# Altium schematic sheet AdapterBoard.SchDoc
size C
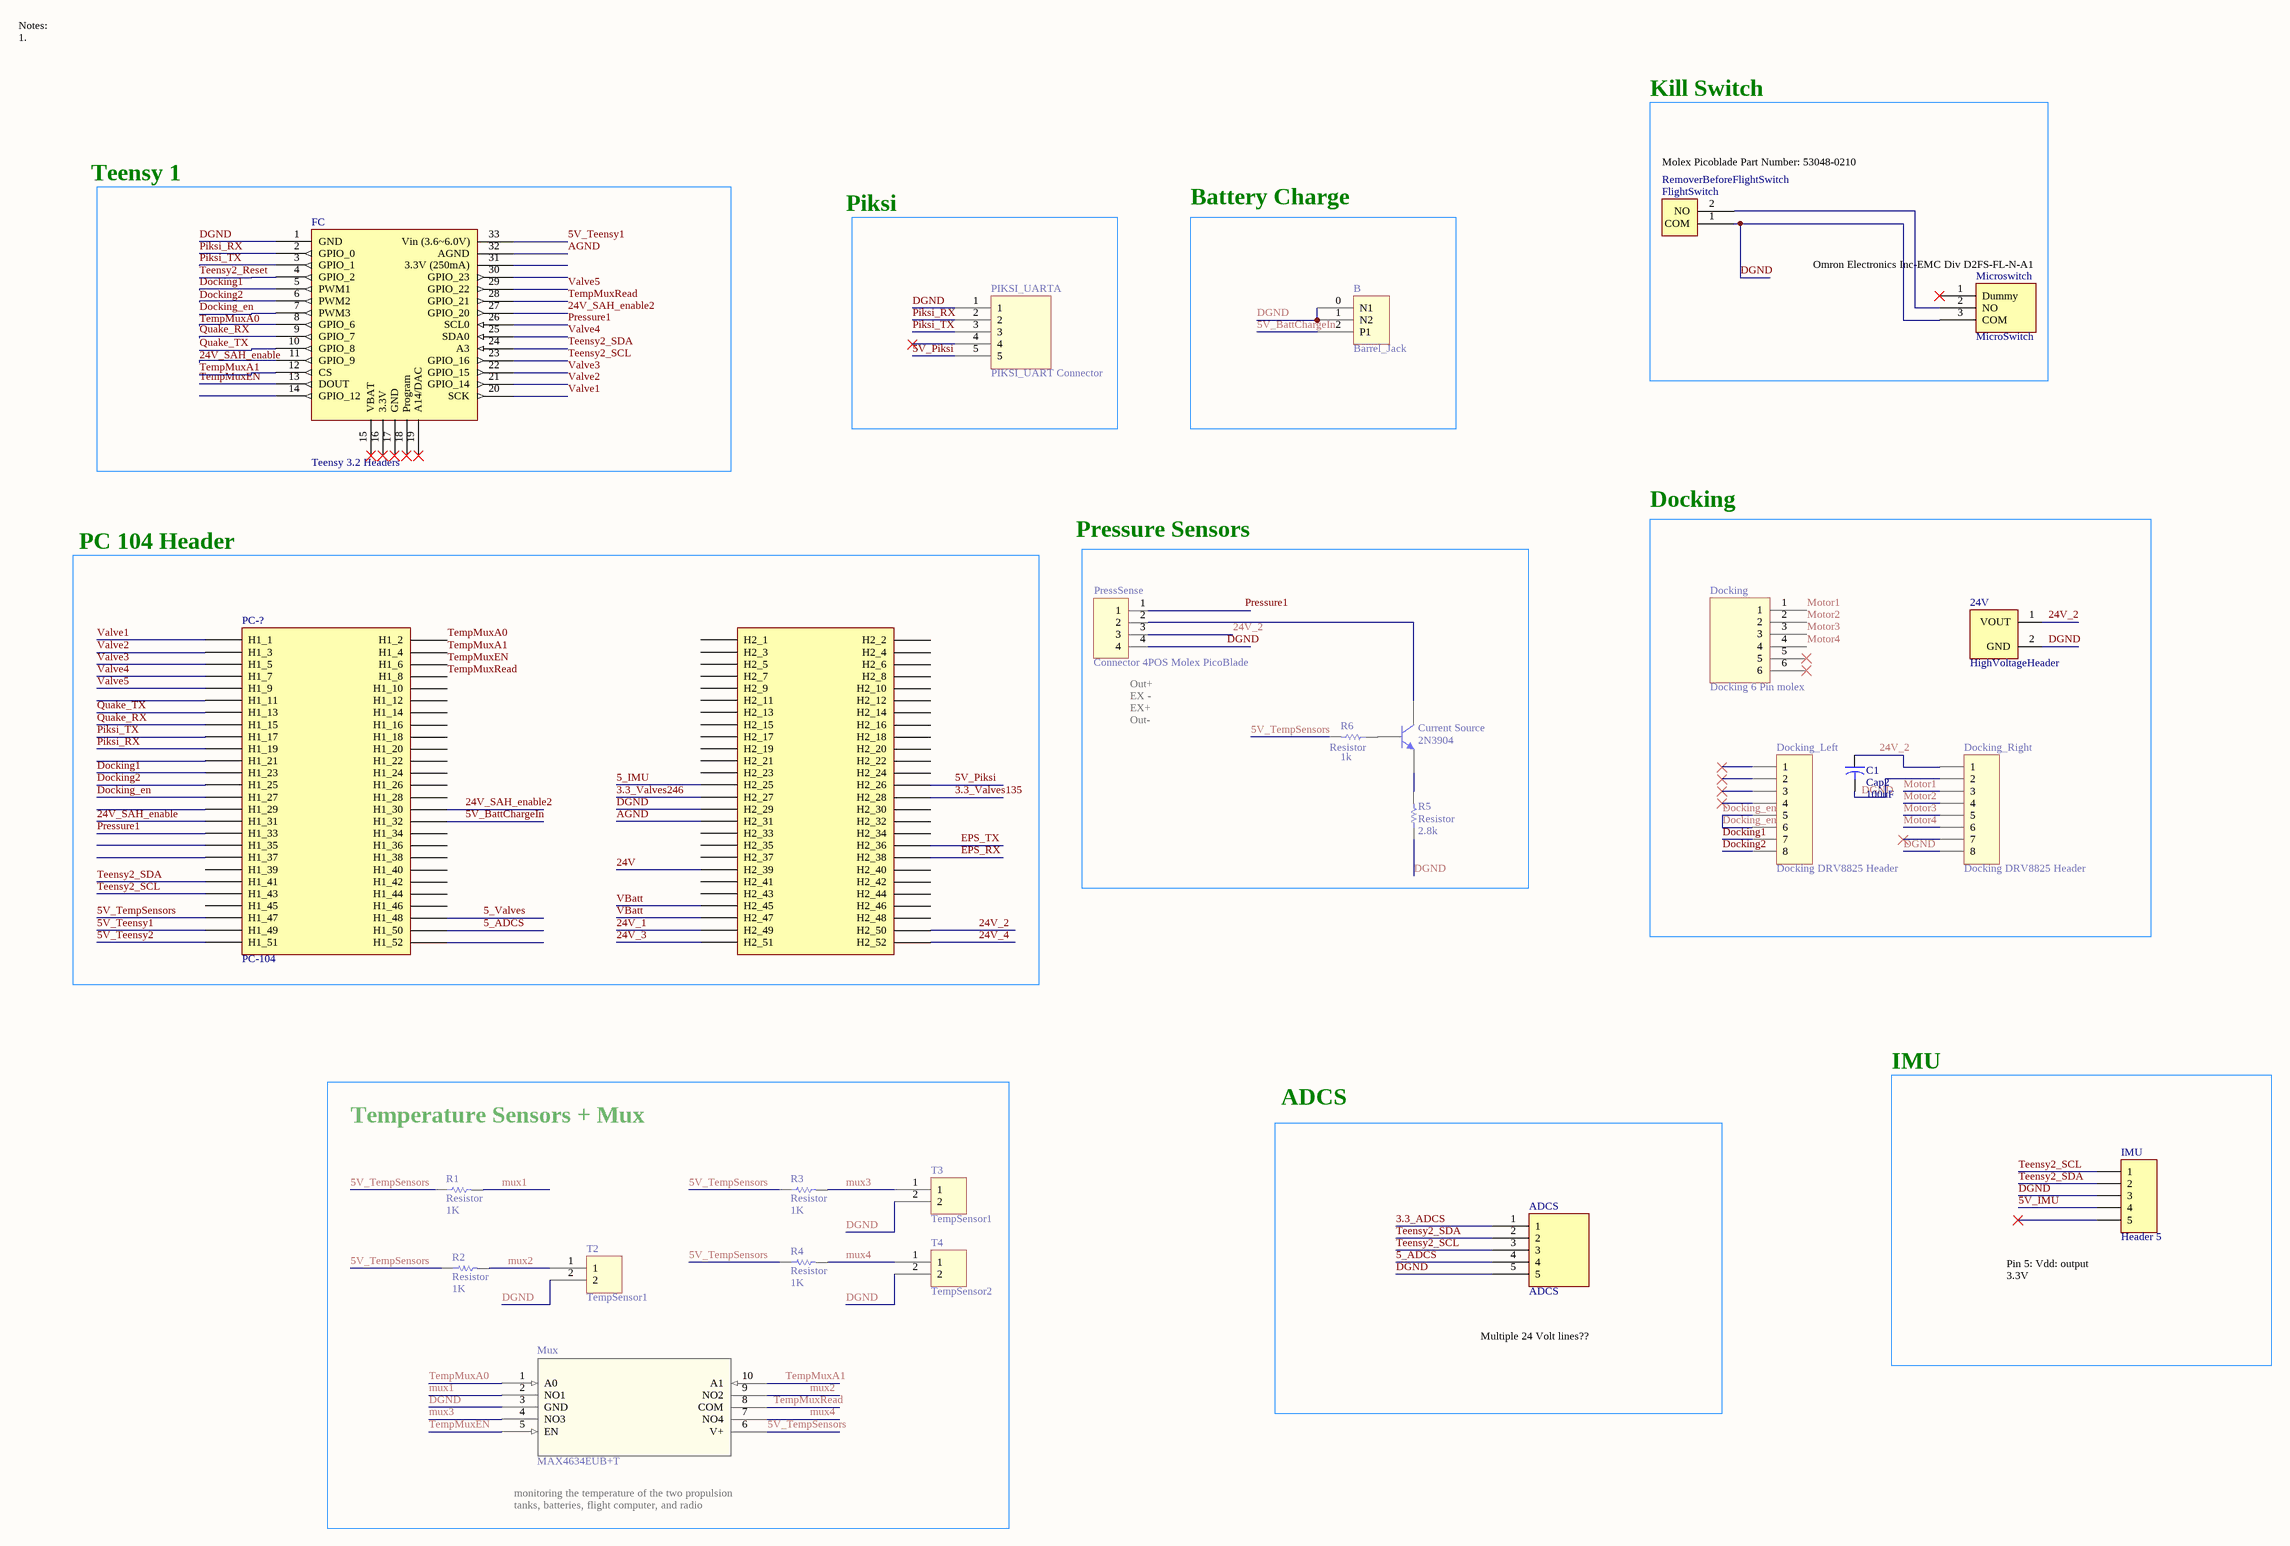
[diagram p0: AdapterBoard.SchDoc]

## Parts
24V  HighVoltageHeader  [Header]
ADCS  ADCS  [Molex Picoblade 5 Pin]
B  Barrel_Jack  [Barrel_Jack]
C1  Cap2  value 100uF  [CAPR5-4X5]
Current_Source  2N3904  [TO-92A]
Docking  Docking 6 Pin molex  [Pressure Connector]
Docking_Left  Docking DRV8825 Header  [HDR1X8]
Docking_Right  Docking DRV8825 Header  [HDR1X8]
FC  Teensy 3.2 Headers  [Teensy 3.2 SMD Headers]
FlightSwitch  RemoverBeforeFlightSwitch  [RemoverBeforeFlight Switch]
IMU  Header 5  [HDR1X5]
Microswitch  MicroSwitch  [MicroSwitch_3pin]
Mux  MAX4634EUB+T  [21-0061L]
PC-?  PC-104  [PC-104FOOTPRINT]
PIKSI_UARTA  PIKSI_UART Connector  [Molex Picoblade 5 Pin]
PressSense  Connector 4POS Molex PicoBlade  [532610471]
R1  Resistor  value 1K  [AXIAL-0.3]
R2  Resistor  value 1K  [AXIAL-0.3]
R3  Resistor  value 1K  [AXIAL-0.3]
R4  Resistor  value 1K  [AXIAL-0.3]
R5  Resistor  value 2.8k  [AXIAL-0.3]
R6  Resistor  value 1k  [AXIAL-0.3]
T2  TempSensor1  [RemoverBeforeFlight Switch]
T3  TempSensor1  [RemoverBeforeFlight Switch]
T4  TempSensor2  [RemoverBeforeFlight Switch]

## Blocks framed on the sheet
Kill Switch: FlightSwitch Microswitch
Battery Charge: B
Docking: 24V C1 Docking Docking_Left Docking_Right
PC 104 Header: PC-?
Temperature Sensors + Mux: Mux R1-R4 T2-T4
IMU: IMU
ADCS: ADCS

## Nets
3.3_ADCS: ADCS.1
3.3_Valves135: PC-?.H2_28
3.3_Valves246: PC-?.H2_27
5_ADCS: ADCS.4 PC-?.H1_50
5_IMU: PC-?.H2_25
5_Valves: PC-?.H1_48
5V_BattChargeIn: B.2(P1) PC-?.H1_32
5V_IMU: IMU.4
5V_Piksi: PC-?.H2_26 PIKSI_UARTA.5
5V_Teensy1: FC.33(Vin_(3.6~6.0V)) PC-?.H1_49
5V_Teensy2: PC-?.H1_51
5V_TempSensors: Mux.6(V+) PC-?.H1_47 R1.1 R2.1 R3.1 R4.1 R6.2
24V: PC-?.H2_39
24V_1: PC-?.H2_49
24V_2: 24V.1(VOUT) C1.1 Docking_Right.1 PC-?.H2_50 PressSense.3
24V_3: PC-?.H2_51
24V_4: PC-?.H2_52
24V_SAH_enable: FC.11(GPIO_9) PC-?.H1_31
24V_SAH_enable2: FC.27(GPIO_20) PC-?.H1_30
AGND: FC.32(AGND) PC-?.H2_31
DGND: 24V.2(GND) ADCS.5 B.0(N1) B.1(N2) C1.2 Docking_Right.2 Docking_Right.8 FC.1(GND) FlightSwitch.1(COM) IMU.3 Microswitch.3(COM) Mux.3(GND) PC-?.H2_29 PIKSI_UARTA.1 PressSense.4 R5.1 T2.2 T3.2 T4.2
Docking1: Docking_Left.7 FC.5(PWM1) PC-?.H1_23
Docking2: Docking_Left.8 FC.6(PWM2) PC-?.H1_25
Docking_en: Docking_Left.5 Docking_Left.6 FC.7(PWM3) PC-?.H1_27
EPS_RX: PC-?.H2_38
EPS_TX: PC-?.H2_36
Motor1: Docking.1 Docking_Right.3
Motor2: Docking.2 Docking_Right.4
Motor3: Docking.3 Docking_Right.5
Motor4: Docking.4 Docking_Right.6
mux1: Mux.2(NO1) R1.2
mux2: Mux.9(NO2) R2.2 T2.1
mux3: Mux.4(NO3) R3.2 T3.1
mux4: Mux.7(NO4) R4.2 T4.1
Piksi_RX: FC.2(GPIO_0) PC-?.H1_19 PIKSI_UARTA.2
Piksi_TX: FC.3(GPIO_1) PC-?.H1_17 PIKSI_UARTA.3
Pressure1: FC.26(SCL0) PC-?.H1_33
Quake_RX: FC.9(GPIO_7) PC-?.H1_15
Quake_TX: FC.10(GPIO_8) PC-?.H1_13
Teensy2_Reset: FC.4(GPIO_2)
Teensy2_SCL: ADCS.3 FC.23(GPIO_16) IMU.1 PC-?.H1_43
Teensy2_SDA: ADCS.2 FC.24(A3) IMU.2 PC-?.H1_41
TempMuxA0: FC.8(GPIO_6) Mux.1(A0) PC-?.H1_2
TempMuxA1: FC.12(CS) Mux.10(A1) PC-?.H1_4
TempMuxEN: FC.13(DOUT) Mux.5(EN) PC-?.H1_6
TempMuxRead: FC.28(GPIO_21) Mux.8(COM) PC-?.H1_8
Valve1: FC.20(SCK) PC-?.H1_1
Valve2: FC.21(GPIO_14) PC-?.H1_3
Valve3: FC.22(GPIO_15) PC-?.H1_5
Valve4: FC.25(SDA0) PC-?.H1_7
Valve5: FC.29(GPIO_22) PC-?.H1_9
VBatt: PC-?.H2_45 PC-?.H2_47
NetCurrent_Source_1: Current_Source.1(E) R5.2
NetCurrent_Source_2: Current_Source.2(B) R6.1
NetCurrent_Source_3: Current_Source.3(C) PressSense.2
NetFlightSwitch_2: FlightSwitch.2(NO) Microswitch.2(NO)

Not connected (* = marked no-connect by the designer): Docking 5* 6*; Docking_Left 1* 2* 3* 4*; Docking_Right 7*; FC 14(GPIO_12) 15(VBAT)* 16(3.3V)* 17(GND)* 18(Program)* 19(A14/DAC)* 30(GPIO_23) 31(3.3V_(250mA)); IMU 5*; Microswitch 1(Dummy)*; PC-? H1_10 H1_11 H1_12 H1_14 H1_16 H1_18 H1_20 H1_21 H1_22 H1_24 H1_26 H1_28 H1_29 H1_34 H1_35 H1_36 H1_37 H1_38 H1_39 H1_40 H1_42 H1_44 H1_45 H1_46 H1_52 H2_1 H2_2 H2_3 H2_4 H2_5 H2_6 H2_7 H2_8 H2_9 H2_10 H2_11 H2_12 H2_13 H2_14 H2_15 H2_16 H2_17 H2_18 H2_19 H2_20 H2_21 H2_22 H2_23 H2_24 H2_30 H2_32 H2_33 H2_34 H2_35 H2_37 H2_40 H2_41 H2_42 H2_43 H2_44 H2_46 H2_48; PIKSI_UARTA 4*; PressSense 1

## Notes on the sheet
- Notes:
  1.
- Teensy 1
- Piksi
- (near FlightSwitch) Molex Picoblade Part Number: 53048-0210
- (near Microswitch) Omron Electronics Inc-EMC Div D2FS-FL-N-A1
- Pressure Sensors
- (near PressSense) Out+
  EX -
  EX+
  Out-
- (near IMU) Pin 5: Vdd: output 3.3V
- Multiple 24 Volt lines??
- monitoring the temperature of the two propulsion tanks, batteries, flight computer, and radio
- Labels drawn without touching a wire or pin: Pressure1

## Library data of the parts
ADCS PIKSI_UARTA = PIKSI_UART Connector: Molex Picoblade 53261-0571
C1 = Cap2: Capacitor; Published: 23-Sep-2002; PackageReference: CAPR5-4X5; Publisher: Altium Limited; PackageDescription: Capacitor; 2 Leads
Current_Source = 2N3904: NPN General Purpose Amplifier; Published: 8-Jun-2000; LatestRevisionDate: 15-Jan-2003; LatestRevisionNote: PCB Footprint 'BCY-W3/D4.7' replaced; DatasheetVersion: 1997; PackageVersion: Sep-1998; PackageReference: TO-92A; Publisher: Altium Limited; PackageDescription: TO, Flat Index; 3 In-Line, Axial Leads; Body Dia. 4.5mm; Leads 0.51 x 0.48 mm (max); ComponentLink1Description: Manufacturer Link; ComponentLink1URL: http://www.fairchildsemi.com/; ComponentLink2Description: Datasheet; ComponentLink2URL: http://www.fairchildsemi.com/ds/2N%2F2N3904.pdf
Docking = PressureConnector: Molex 70553-0005
Docking_Left Docking_Right = Header 8: Header, 8-Pin; LatestRevisionDate: 17-Jul-2002; LatestRevisionNote: Re-released for DXP Platform.; Publisher: Altium Limited
FlightSwitch T2-T4 = RemoverBeforeFlightSwitch: 53048-0210 Molex Picoblade
IMU = Header 5: Header, 5-Pin; LatestRevisionDate: 17-Jul-2002; LatestRevisionNote: Re-released for DXP Platform.; Publisher: Altium Limited
Microswitch = MicroSwitch: Omron Electronics Inc-EMC Div D2FS-FL-N-A1
Mux = MAX4634EUB+T: Imported; Vendor: Maxim Integrated Products; C: Copyright (C) 2015 Accelerated Designs. All rights reserved; Manufacturer_Part_Number: MAX4634EUB+T; Value: Value; Type: Type; RefDes: RefDes
PC-? = PC-104: ESQ-126-14-G-D (2 total needed)
PressSense = 532610471
R1-R6 = Res1: Published: 8-Jun-2000; LatestRevisionDate: 17-Jul-2002; LatestRevisionNote: Re-released for DXP Platform.; PackageReference: AXIAL-0.3; Publisher: Altium Limited; PackageDescription: Axial Device, Thru-Hole; 2 Leads; 0.3 in Pin Spacing